# Altium schematic sheet HPCC_Connector_B.SchDoc
size B; SheetNumber: 5; SheetTotal: 11
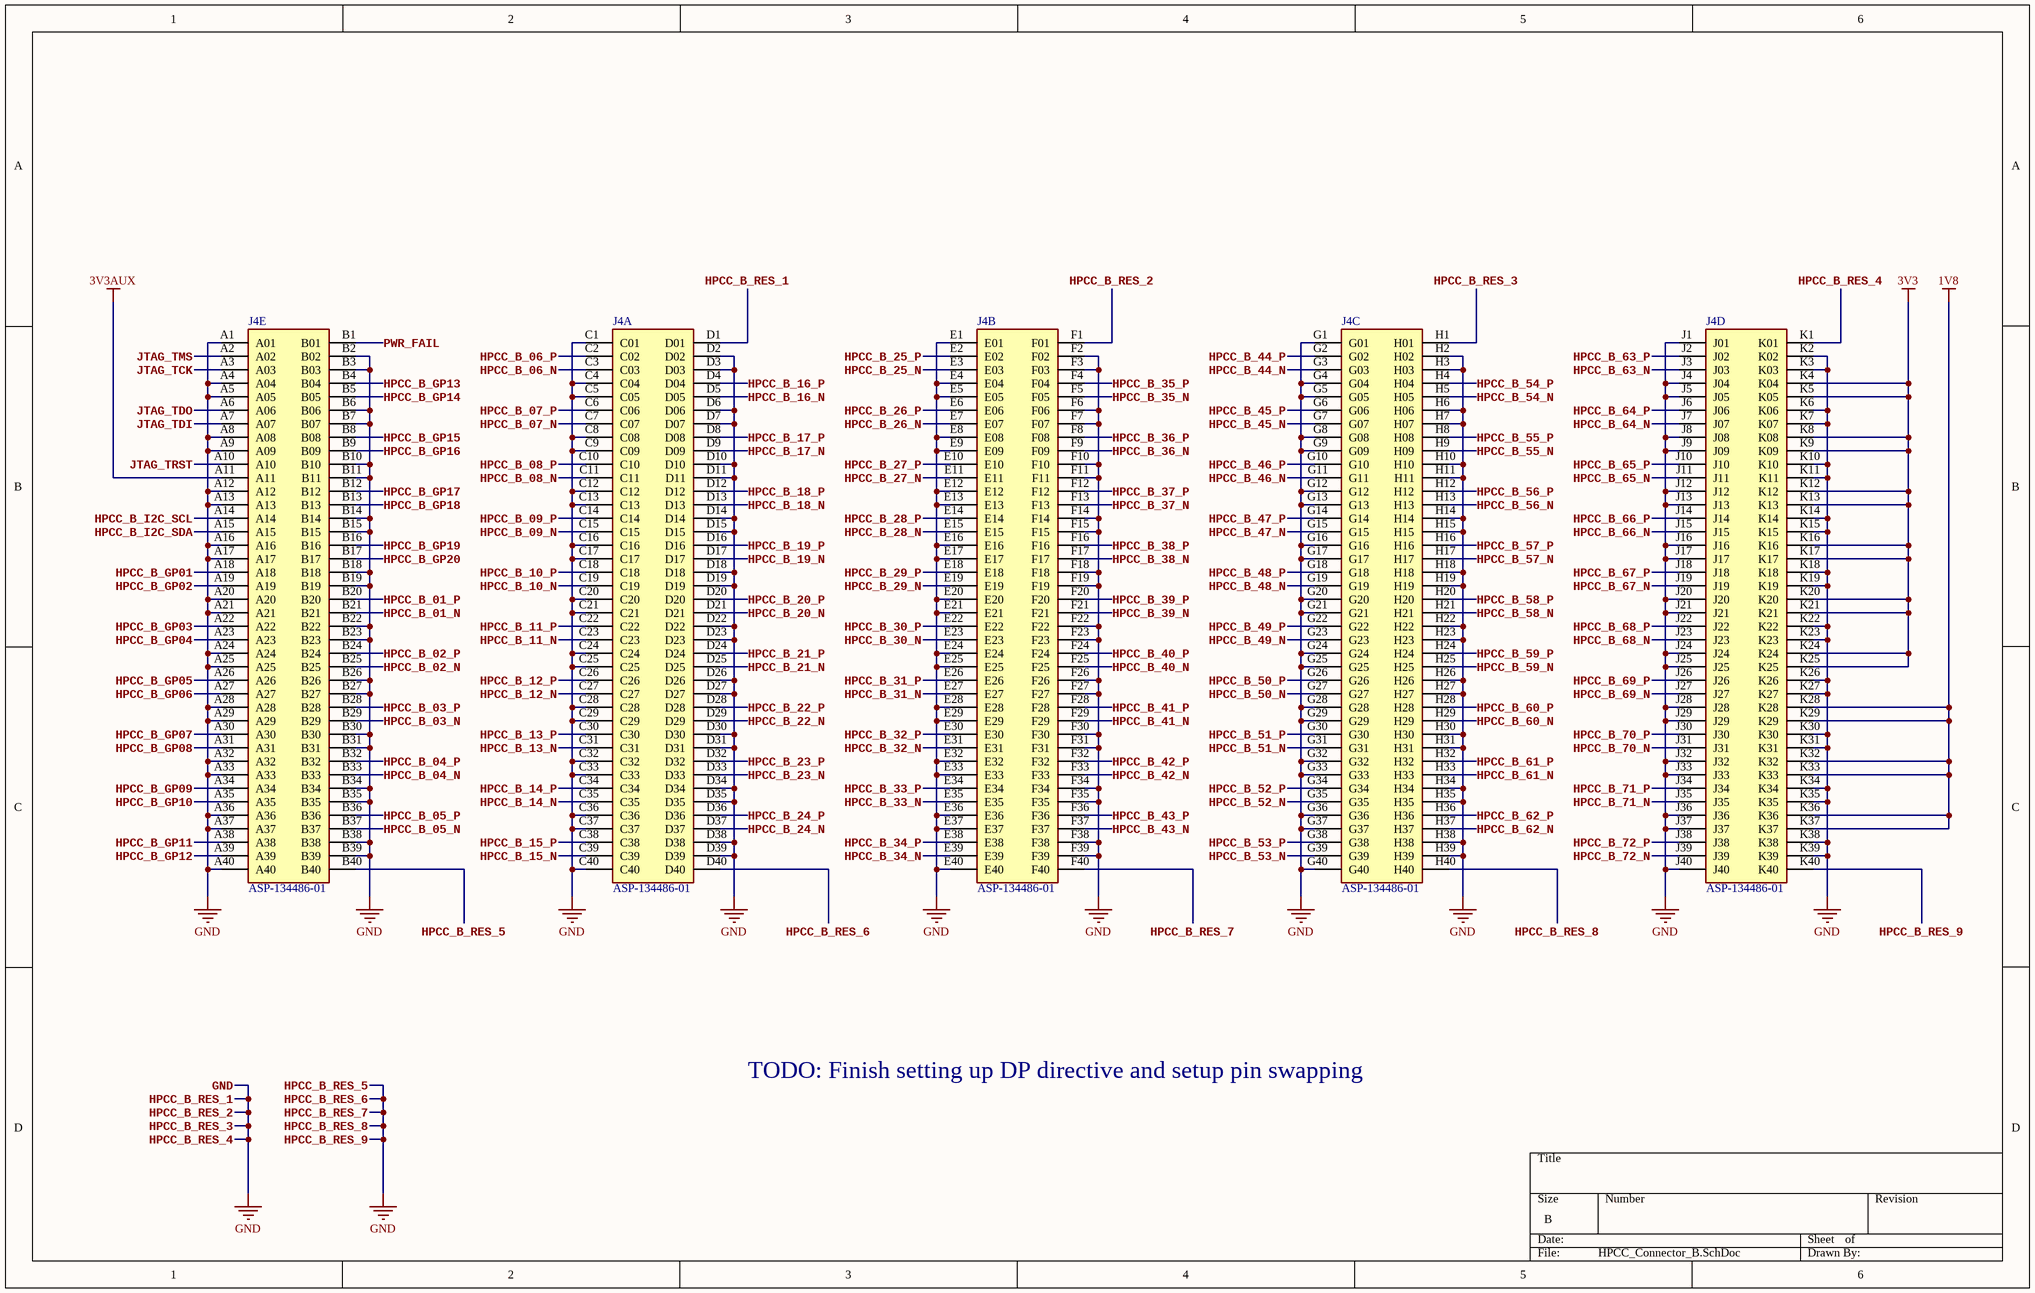
[diagram p0: HPCC_Connector_B.SchDoc]

## Parts
J4  ASP-134486-01  [SAMTEC_ASP-134486-01]  (parts A,B,C,D,E of 5)

## Nets
1V8: J4.K28 J4.K29 J4.K32 J4.K33 J4.K36 J4.K37
3V3: J4.K4(K04) J4.K5(K05) J4.K8(K08) J4.K9(K09) J4.K12 J4.K13 J4.K16 J4.K17 J4.K20 J4.K21 J4.K24 J4.K25
3V3AUX: J4.A11
GND: J4.A1(A01) J4.A4(A04) J4.A5(A05) J4.A8(A08) J4.A9(A09) J4.A12 J4.A13 J4.A16 J4.A17 J4.A20 J4.A21 J4.A24 J4.A25 J4.A28 J4.A29 J4.A32 J4.A33 J4.A36 J4.A37 J4.A40 J4.B2(B02) J4.B3(B03) J4.B6(B06) J4.B7(B07) J4.B10 J4.B11 J4.B14 J4.B15 J4.B18 J4.B19 J4.B22 J4.B23 J4.B26 J4.B27 J4.B30 J4.B31 J4.B34 J4.B35 J4.B38 J4.B39 J4.B40 J4.C1(C01) J4.C4(C04) J4.C5(C05) J4.C8(C08) J4.C9(C09) J4.C12 J4.C13 J4.C16 J4.C17 J4.C20 J4.C21 J4.C24 J4.C25 J4.C28 J4.C29 J4.C32 J4.C33 J4.C36 J4.C37 J4.C40 J4.D1(D01) J4.D2(D02) J4.D3(D03) J4.D6(D06) J4.D7(D07) J4.D10 J4.D11 J4.D14 J4.D15 J4.D18 J4.D19 J4.D22 J4.D23 J4.D26 J4.D27 J4.D30 J4.D31 J4.D34 J4.D35 J4.D38 J4.D39 J4.D40 J4.E1(E01) J4.E4(E04) J4.E5(E05) J4.E8(E08) J4.E9(E09) J4.E12 J4.E13 J4.E16 J4.E17 J4.E20 J4.E21 J4.E24 J4.E25 J4.E28 J4.E29 J4.E32 J4.E33 J4.E36 J4.E37 J4.E40 J4.F1(F01) J4.F2(F02) J4.F3(F03) J4.F6(F06) J4.F7(F07) J4.F10 J4.F11 J4.F14 J4.F15 J4.F18 J4.F19 J4.F22 J4.F23 J4.F26 J4.F27 J4.F30 J4.F31 J4.F34 J4.F35 J4.F38 J4.F39 J4.F40 J4.G1(G01) J4.G4(G04) J4.G5(G05) J4.G8(G08) J4.G9(G09) J4.G12 J4.G13 J4.G16 J4.G17 J4.G20 J4.G21 J4.G24 J4.G25 J4.G28 J4.G29 J4.G32 J4.G33 J4.G36 J4.G37 J4.G40 J4.H1(H01) J4.H2(H02) J4.H3(H03) J4.H6(H06) J4.H7(H07) J4.H10 J4.H11 J4.H14 J4.H15 J4.H18 J4.H19 J4.H22 J4.H23 J4.H26 J4.H27 J4.H30 J4.H31 J4.H34 J4.H35 J4.H38 J4.H39 J4.H40 J4.J1(J01) J4.J4(J04) J4.J5(J05) J4.J8(J08) J4.J9(J09) J4.J12 J4.J13 J4.J16 J4.J17 J4.J20 J4.J21 J4.J24 J4.J25 J4.J28 J4.J29 J4.J32 J4.J33 J4.J36 J4.J37 J4.J40 J4.K1(K01) J4.K2(K02) J4.K3(K03) J4.K6(K06) J4.K7(K07) J4.K10 J4.K11 J4.K14 J4.K15 J4.K18 J4.K19 J4.K22 J4.K23 J4.K26 J4.K27 J4.K30 J4.K31 J4.K34 J4.K35 J4.K38 J4.K39 J4.K40  [also labelled HPCC_B_RES_1, HPCC_B_RES_2, HPCC_B_RES_3, HPCC_B_RES_4, HPCC_B_RES_5, HPCC_B_RES_6, HPCC_B_RES_7, HPCC_B_RES_8, HPCC_B_RES_9]
HPCC_B_01_N: J4.B21
HPCC_B_01_P: J4.B20
HPCC_B_02_N: J4.B25
HPCC_B_02_P: J4.B24
HPCC_B_03_N: J4.B29
HPCC_B_03_P: J4.B28
HPCC_B_04_N: J4.B33
HPCC_B_04_P: J4.B32
HPCC_B_05_N: J4.B37
HPCC_B_05_P: J4.B36
HPCC_B_06_N: J4.C3(C03)
HPCC_B_06_P: J4.C2(C02)
HPCC_B_07_N: J4.C7(C07)
HPCC_B_07_P: J4.C6(C06)
HPCC_B_08_N: J4.C11
HPCC_B_08_P: J4.C10
HPCC_B_09_N: J4.C15
HPCC_B_09_P: J4.C14
HPCC_B_10_N: J4.C19
HPCC_B_10_P: J4.C18
HPCC_B_11_N: J4.C23
HPCC_B_11_P: J4.C22
HPCC_B_12_N: J4.C27
HPCC_B_12_P: J4.C26
HPCC_B_13_N: J4.C31
HPCC_B_13_P: J4.C30
HPCC_B_14_N: J4.C35
HPCC_B_14_P: J4.C34
HPCC_B_15_N: J4.C39
HPCC_B_15_P: J4.C38
HPCC_B_16_N: J4.D5(D05)
HPCC_B_16_P: J4.D4(D04)
HPCC_B_17_N: J4.D9(D09)
HPCC_B_17_P: J4.D8(D08)
HPCC_B_18_N: J4.D13
HPCC_B_18_P: J4.D12
HPCC_B_19_N: J4.D17
HPCC_B_19_P: J4.D16
HPCC_B_20_N: J4.D21
HPCC_B_20_P: J4.D20
HPCC_B_21_N: J4.D25
HPCC_B_21_P: J4.D24
HPCC_B_22_N: J4.D29
HPCC_B_22_P: J4.D28
HPCC_B_23_N: J4.D33
HPCC_B_23_P: J4.D32
HPCC_B_24_N: J4.D37
HPCC_B_24_P: J4.D36
HPCC_B_25_N: J4.E3(E03)
HPCC_B_25_P: J4.E2(E02)
HPCC_B_26_N: J4.E7(E07)
HPCC_B_26_P: J4.E6(E06)
HPCC_B_27_N: J4.E11
HPCC_B_27_P: J4.E10
HPCC_B_28_N: J4.E15
HPCC_B_28_P: J4.E14
HPCC_B_29_N: J4.E19
HPCC_B_29_P: J4.E18
HPCC_B_30_N: J4.E23
HPCC_B_30_P: J4.E22
HPCC_B_31_N: J4.E27
HPCC_B_31_P: J4.E26
HPCC_B_32_N: J4.E31
HPCC_B_32_P: J4.E30
HPCC_B_33_N: J4.E35
HPCC_B_33_P: J4.E34
HPCC_B_34_N: J4.E39
HPCC_B_34_P: J4.E38
HPCC_B_35_N: J4.F5(F05)
HPCC_B_35_P: J4.F4(F04)
HPCC_B_36_N: J4.F9(F09)
HPCC_B_36_P: J4.F8(F08)
HPCC_B_37_N: J4.F13
HPCC_B_37_P: J4.F12
HPCC_B_38_N: J4.F17
HPCC_B_38_P: J4.F16
HPCC_B_39_N: J4.F21
HPCC_B_39_P: J4.F20
HPCC_B_40_N: J4.F25
HPCC_B_40_P: J4.F24
HPCC_B_41_N: J4.F29
HPCC_B_41_P: J4.F28
HPCC_B_42_N: J4.F33
HPCC_B_42_P: J4.F32
HPCC_B_43_N: J4.F37
HPCC_B_43_P: J4.F36
HPCC_B_44_N: J4.G3(G03)
HPCC_B_44_P: J4.G2(G02)
HPCC_B_45_N: J4.G7(G07)
HPCC_B_45_P: J4.G6(G06)
HPCC_B_46_N: J4.G11
HPCC_B_46_P: J4.G10
HPCC_B_47_N: J4.G15
HPCC_B_47_P: J4.G14
HPCC_B_48_N: J4.G19
HPCC_B_48_P: J4.G18
HPCC_B_49_N: J4.G23
HPCC_B_49_P: J4.G22
HPCC_B_50_N: J4.G27
HPCC_B_50_P: J4.G26
HPCC_B_51_N: J4.G31
HPCC_B_51_P: J4.G30
HPCC_B_52_N: J4.G35
HPCC_B_52_P: J4.G34
HPCC_B_53_N: J4.G39
HPCC_B_53_P: J4.G38
HPCC_B_54_N: J4.H5(H05)
HPCC_B_54_P: J4.H4(H04)
HPCC_B_55_N: J4.H9(H09)
HPCC_B_55_P: J4.H8(H08)
HPCC_B_56_N: J4.H13
HPCC_B_56_P: J4.H12
HPCC_B_57_N: J4.H17
HPCC_B_57_P: J4.H16
HPCC_B_58_N: J4.H21
HPCC_B_58_P: J4.H20
HPCC_B_59_N: J4.H25
HPCC_B_59_P: J4.H24
HPCC_B_60_N: J4.H29
HPCC_B_60_P: J4.H28
HPCC_B_61_N: J4.H33
HPCC_B_61_P: J4.H32
HPCC_B_62_N: J4.H37
HPCC_B_62_P: J4.H36
HPCC_B_63_N: J4.J3(J03)
HPCC_B_63_P: J4.J2(J02)
HPCC_B_64_N: J4.J7(J07)
HPCC_B_64_P: J4.J6(J06)
HPCC_B_65_N: J4.J11
HPCC_B_65_P: J4.J10
HPCC_B_66_N: J4.J15
HPCC_B_66_P: J4.J14
HPCC_B_67_N: J4.J19
HPCC_B_67_P: J4.J18
HPCC_B_68_N: J4.J23
HPCC_B_68_P: J4.J22
HPCC_B_69_N: J4.J27
HPCC_B_69_P: J4.J26
HPCC_B_70_N: J4.J31
HPCC_B_70_P: J4.J30
HPCC_B_71_N: J4.J35
HPCC_B_71_P: J4.J34
HPCC_B_72_N: J4.J39
HPCC_B_72_P: J4.J38
HPCC_B_GP01: J4.A18
HPCC_B_GP02: J4.A19
HPCC_B_GP03: J4.A22
HPCC_B_GP04: J4.A23
HPCC_B_GP05: J4.A26
HPCC_B_GP06: J4.A27
HPCC_B_GP07: J4.A30
HPCC_B_GP08: J4.A31
HPCC_B_GP09: J4.A34
HPCC_B_GP10: J4.A35
HPCC_B_GP11: J4.A38
HPCC_B_GP12: J4.A39
HPCC_B_GP13: J4.B4(B04)
HPCC_B_GP14: J4.B5(B05)
HPCC_B_GP15: J4.B8(B08)
HPCC_B_GP16: J4.B9(B09)
HPCC_B_GP17: J4.B12
HPCC_B_GP18: J4.B13
HPCC_B_GP19: J4.B16
HPCC_B_GP20: J4.B17
HPCC_B_I2C_SCL: J4.A14
HPCC_B_I2C_SDA: J4.A15
JTAG_TCK: J4.A3(A03)
JTAG_TDI: J4.A7(A07)
JTAG_TDO: J4.A6(A06)
JTAG_TMS: J4.A2(A02)
JTAG_TRST: J4.A10
PWR_FAIL: J4.B1(B01)

## Notes on the sheet
- TODO: Finish setting up DP directive and setup pin swapping

## Library data of the parts
J4 = ASP-134486-01: 400 Position Connector Array, Female Sockets Surface Mount Gold; Manufacturer: Samtec; Manufacturer Part Number: ASP-134486-01